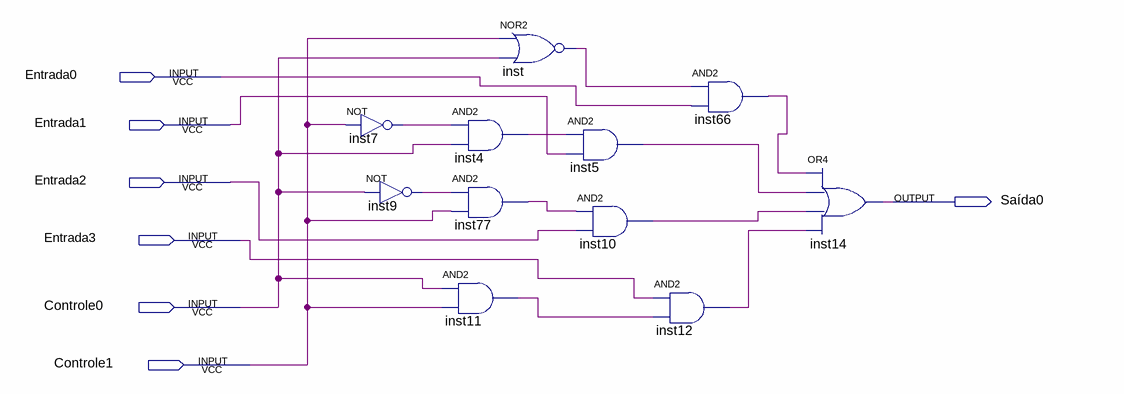
[diagram p0: schematic sheet]
// Quartus schematic mux4x1.bdf as structural Verilog: 11 symbols, 7 pins
module mux4x1 (
  input  Entrada0,
  input  Entrada1,
  input  Entrada2,
  input  Entrada3,
  input  Controle0,
  input  Controle1,
  output \Saída0 
);

  wire inst4_out, inst5_out, inst7_out, inst9_out, inst10_out, inst11_out, inst12_out, inst66_out,
       inst77_out, inst_out;

  not inst7 (inst7_out, Controle1);
  not inst9 (inst9_out, Controle0);
  nor inst (inst_out, Controle1, Controle0);
  and inst4 (inst4_out, inst7_out, Controle0);
  and inst77 (inst77_out, inst9_out, Controle1);
  and inst11 (inst11_out, Controle0, Controle1);
  and inst5 (inst5_out, inst4_out, Entrada1);
  and inst10 (inst10_out, inst77_out, Entrada2);
  and inst12 (inst12_out, Entrada3, inst11_out);
  and inst66 (inst66_out, inst_out, Entrada0);
  or inst14 (\Saída0 , inst66_out, inst5_out, inst10_out, inst12_out);
endmodule
